# EAGLE schematic GeigerCounter (EAGLE 6.5.0)
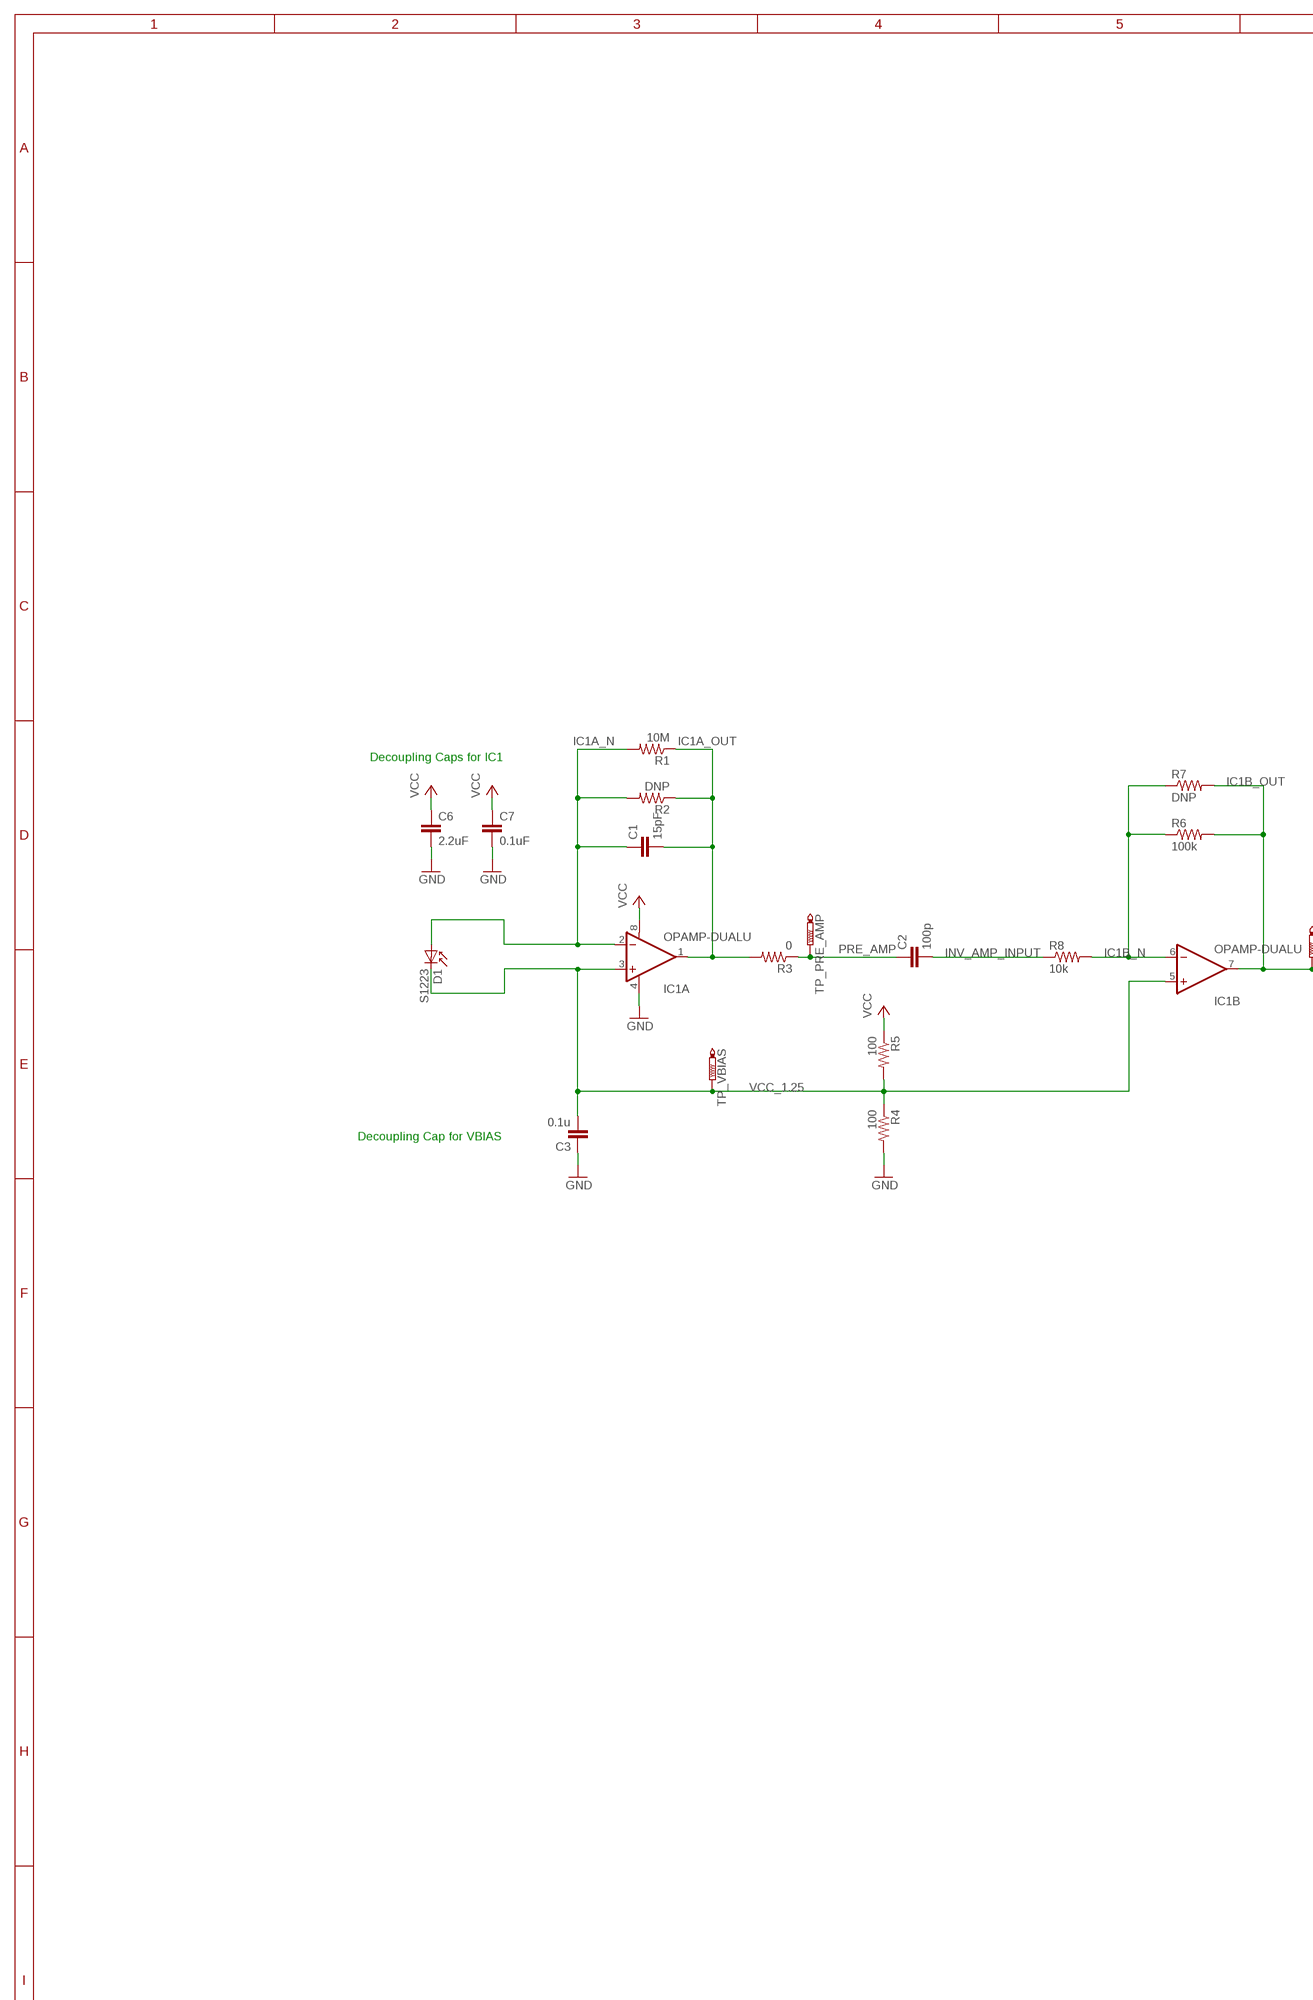
[diagram p0: schematic, sheet 1, part 1 of 2]
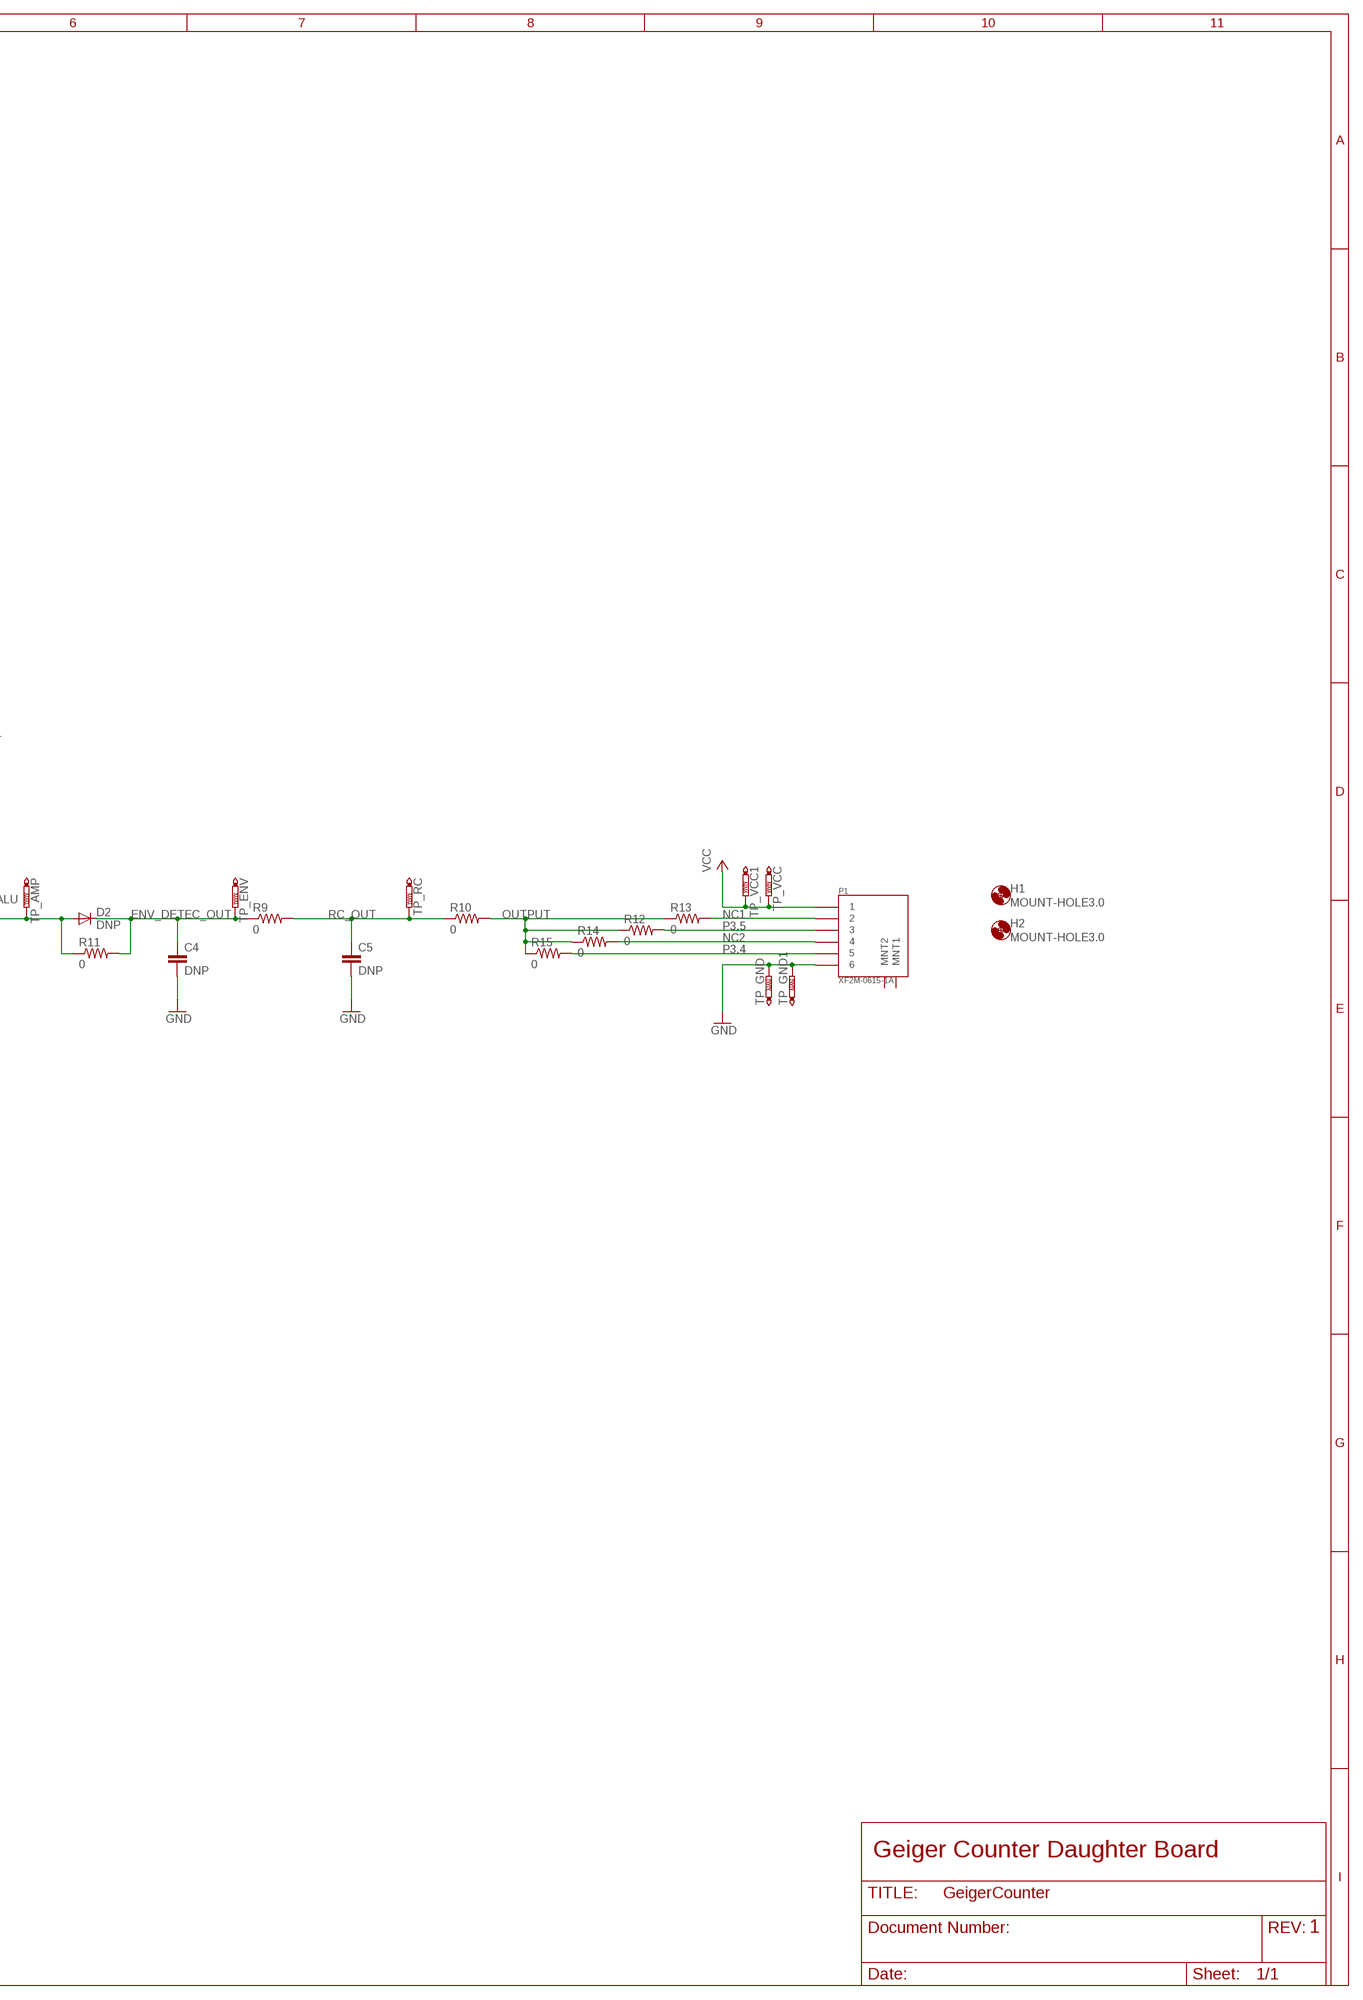
[diagram p1: schematic, sheet 1, part 2 of 2]

## Parts
C1  15pF  CAP0603-CAP  [0603-CAP]
C2  100p  CAP0603-CAP  [0603-CAP]
C3  0.1u  CAP0603-CAP  [0603-CAP]
C4  DNP  CAP0603-CAP  [0603-CAP]
C5  DNP  CAP0603-CAP  [0603-CAP]
C6  2.2uF  CAP0603-CAP  [0603-CAP]
C7  0.1uF  CAP0603-CAP  [0603-CAP]
D1  S1223  [DIODE-1N4001]
D2  DNP  DIODESOT23  [SOT23-3]
H1  MOUNT-HOLE3.0  [3,0]
H2  MOUNT-HOLE3.0  [3,0]
IC1  OPAMP-DUALU  [SO08]
P1  XF2M-0615-1A  [XF2M-0615-1A]
R1  10M  RESISTOR0603-RES  [0603-RES]
R2  DNP  RESISTOR0603-RES  [0603-RES]
R3  0  RESISTOR0603-RES  [0603-RES]
R4  100  RESISTOR0603-RES  [0603-RES]
R5  100  RESISTOR0603-RES  [0603-RES]
R6  100k  RESISTOR0603-RES  [0603-RES]
R7  DNP  RESISTOR0603-RES  [0603-RES]
R8  10k  RESISTOR0603-RES  [0603-RES]
R9  0  RESISTOR0603-RES  [0603-RES]
R10  0  RESISTOR0603-RES  [0603-RES]
R11  0  RESISTOR0603-RES  [0603-RES]
R12  0  RESISTOR0603-RES  [0603-RES]
R13  0  RESISTOR0603-RES  [0603-RES]
R14  0  RESISTOR0603-RES  [0603-RES]
R15  0  RESISTOR0603-RES  [0603-RES]
TP_AMP  PTR1PAD1-20  [P1-20]
TP_ENV  PTR1PAD1-20  [P1-20]
TP_GND  PTR1PAD1-20  [P1-20]
TP_GND1  PTR1PAD1-20  [P1-20]
TP_PRE_AMP  PTR1PAD1-20  [P1-20]
TP_RC  PTR1PAD1-20  [P1-20]
TP_VBIAS  PTR1PAD1-20  [P1-20]
TP_VCC  PTR1PAD1-20  [P1-20]
TP_VCC1  PTR1PAD1-20  [P1-20]

## Nets
ENV_DETEC_OUT: C4.1 D2.3(C) R9.1 R11.2 TP_ENV.TP
GND: C3.1 C4.2 C5.2 C6.2 C7.2 IC1.4(A:V-) P1.6 R4.2 TP_GND1.TP TP_GND.TP
IC1A_N: C1.1 D1.A IC1.2(A:-IN) R1.2 R2.2
IC1A_OUT: C1.2 IC1.1(A:OUT) R1.1 R2.1 R3.2
IC1B_N: IC1.6(B:-IN) R6.1 R7.1 R8.2
IC1B_OUT: D2.1(A) IC1.7(B:OUT) R6.2 R7.2 R11.1 TP_AMP.TP
INV_AMP_INPUT: C2.2 R8.1
NC1: P1.2 R13.2
NC2: P1.4 R14.2
OUTPUT: R10.2 R12.1 R13.1 R14.1 R15.1
P3.4: P1.5 R15.2
P3.5: P1.3 R12.2
PRE_AMP: C2.1 R3.1 TP_PRE_AMP.TP
RC_OUT: C5.1 R9.2 R10.1 TP_RC.TP
VCC: C6.1 C7.1 IC1.8(A:V+) P1.1 R5.1 TP_VCC1.TP TP_VCC.TP
VCC_1.25: C3.2 D1.C IC1.3(A:+IN) IC1.5(B:+IN) R4.1 R5.2 TP_VBIAS.TP
Unconnected: P1.P$7(MNT1) P1.P$8(MNT2)

## Notes on the sheet
- Decoupling Caps for IC1
- Decoupling Cap for VBIAS
- Geiger Counter Daughter Board
- 1

## Library data of the parts
C1-C7 = SparkFun-Passives:CAP: Capacitor Standard 0603 ceramic capacitor, and 0.1" leaded capacitor.
D1 = GeigerCounter:S1223: S1223 PIN Photodiode
D2 = SparkFun-DiscreteSemi:DIODE: Diode These are standard reverse protection diodes and small signal diodes. SMA package can handle up to about 1A. SOD-323 can handle about 200mA. What the SOD-323 package when ordering, there are some mfgs out there that are 5-pin packages.
H1 H2 = holes:MOUNT-HOLE: MOUNTING HOLE with drill center marker
IC1 = SparkFun-AnalogIC:OPAMP-DUAL: Generic op-amp footprint
P1 = GeigerCounter:XF2M-0615-1A: XF2M-0615-1A
R1-R15 = SparkFun-Passives:RESISTOR: Resistor Basic schematic elements and footprints for 0603, 1206, and PTH resistors.
TP_AMP TP_ENV TP_GND TP_GND1 TP_PRE_AMP TP_RC TP_VBIAS TP_VCC TP_VCC1 = testpad:PTR1: TEST PIN